# Altium schematic sheet CW308T_AVR_MICRO.SchDoc: AVR Microcontroller
size Letter; Organization: NewAE Technology Inc.; Address1: 1083 Queen St., Suite 196; Address2: Halifax; Address3: NS; Address4: Canada B3H 0B2; SheetNumber: 1; SheetTotal: 2; SheetApproved: YES
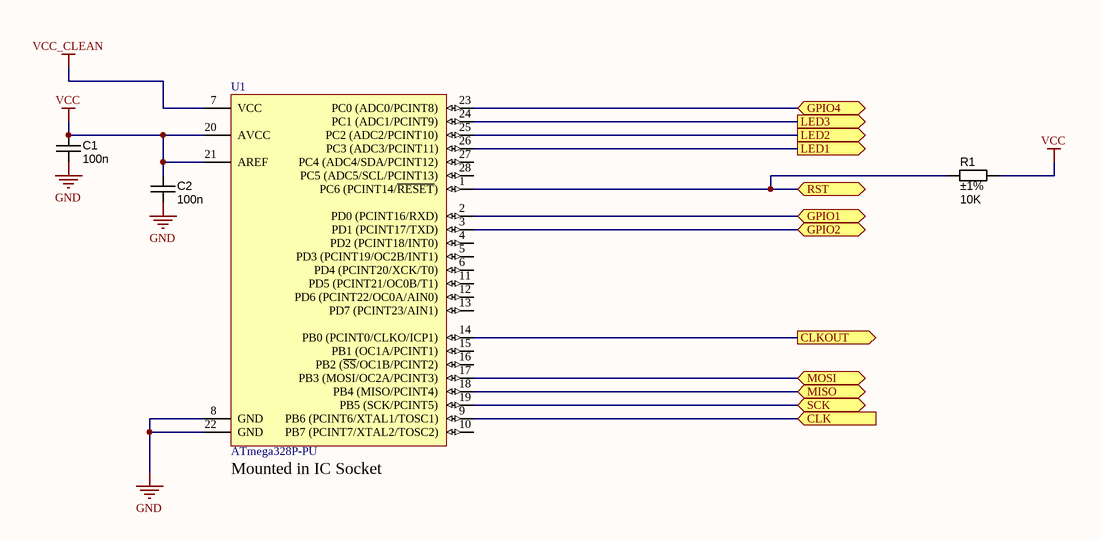
[diagram p0: CW308T_AVR_MICRO.SchDoc]

## Parts
C1  value 100n  [CAPC1608X90N]  (hidden comment: approved sub OK)
C2  value 100n  [CAPC1608X90N]  (hidden comment: approved sub OK)
R1  value 10K  Tolerance: ±1%  [RESC1608X55N]  (hidden comment: Thick Film)
U1  ATmega328P-PU  [28P3]

## Ports
CLK (in), CLKOUT (out), GPIO1 (bidir), GPIO2 (bidir), GPIO4 (bidir), LED1 (out), LED2 (out), LED3 (out), MISO (bidir), MOSI (bidir), RST (bidir), SCK (bidir)

## Nets
GND: C1.2 C2.2 U1.8(GND) U1.22(GND)
VCC: C1.1 C2.1 R1.1 U1.20(AVCC) U1.21(AREF)
VCC_CLEAN: U1.7(VCC)
CLK: U1.9(PB6_(PCINT6/XTAL1/TOSC1)) ; port CLK
CLKOUT: U1.14(PB0_(PCINT0/CLKO/ICP1)) ; port CLKOUT
GPIO1: U1.2(PD0_(PCINT16/RXD)) ; port GPIO1
GPIO2: U1.3(PD1_(PCINT17/TXD)) ; port GPIO2
GPIO4: U1.23(PC0_(ADC0/PCINT8)) ; port GPIO4
LED1: U1.26(PC3_(ADC3/PCINT11)) ; port LED1
LED2: U1.25(PC2_(ADC2/PCINT10)) ; port LED2
LED3: U1.24(PC1_(ADC1/PCINT9)) ; port LED3
MISO: U1.18(PB4_(MISO/PCINT4)) ; port MISO
MOSI: U1.17(PB3_(MOSI/OC2A/PCINT3)) ; port MOSI
RST: R1.2 U1.1(PC6_(PCINT14/~{RESET})) ; port RST
SCK: U1.19(PB5_(SCK/PCINT5)) ; port SCK

Not connected (* = marked no-connect by the designer): U1 4(PD2_(PCINT18/INT0)) 5(PD3_(PCINT19/OC2B/INT1)) 6(PD4_(PCINT20/XCK/T0)) 10(PB7_(PCINT7/XTAL2/TOSC2)) 11(PD5_(PCINT21/OC0B/T1)) 12(PD6_(PCINT22/OC0A/AIN0)) 13(PD7_(PCINT23/AIN1)) 15(PB1_(OC1A/PCINT1)) 16(PB2_(~{SS}/OC1B/PCINT2)) 27(PC4_(ADC4/SDA/PCINT12)) 28(PC5_(ADC5/SCL/PCINT13))

## Notes on the sheet
- (near U1) Mounted in IC Socket
- Title:
- Date:
- Rev:
- Time:
- Project:
- Sheet
- of
- License:
- Copyright © NewAE Technology Inc.
- Approved:
- NewAE.com
- File:

## Library data of the parts
C1 C2 = CAPC_100n_0603_X7R_50V_10%: Capacitor SMD Cer 100nF 10% 50V X7R 0603; Manufacturer 1: AVX Corporation; Manufacturer Part Number 1: 06035C104KAT2A; Ratings: 50V; X7R; Material: ceramic; SCDType: spec; Manufacturer 2: TDK Corporation; Manufacturer Part Number 2: C1608X7R1H104K; Package / Case: 0603 (1608 Metric); Tolerance: ±10%; Supplier 1: Digi-Key; Supplier Part Number 1: 478-5052-1-ND; ComponentLink1URL: http://www.avx.com/docs/Catalogs/cx7r.pdf; ComponentLink1Description: http://www.avx.com/docs/Catalogs/cx7r.pdf; Supplier 2: Digi-Key; Supplier Part Number 2: 445-1314-1-ND; ComponentLink2URL: http://product.tdk.com/capacitor/mlcc/en/documents/mlcc_commercial_general_en.pdf; ComponentLink2Description: http://product.tdk.com/capacitor/mlcc/en/documents/mlcc_commercial_general_en.pdf
R1 = RES_10K_0603_1%: Resistor SMD chip 10k Ohm 0.1W 1% 0603; Manufacturer 1: Yageo; Manufacturer Part Number 1: RC0603FR-0710KL; Ratings: 1/10W; SCDType: spec; Package / Case: 0603 (1608 Metric); Supplier 1: Digi-Key; Supplier Part Number 1: 311-10.0KHRCT-ND
U1 = CMP-0095-00013-2: 8-bit AVR Microcontroller, 32KB Flash, 1KB EEPROM, 2KB SRAM, 28-pin PDIP, Industrial Grade (-40°C to 85°C); RevisionNote: DatasheetVersion updated. URLs added.; PackageVersion: revB, Sep-2001; DatasheetVersion: revD, May-2011; ComponentLink1Description: Manufacturer URL; ComponentLink1URL: http://www.atmel.com/; PackageReference: 28P3; ComponentLink2Description: ATmega48A/48PA/88A/88PA/168A/168PA/328/328P Datasheet; ComponentLink3URL: http://www.atmel.com/dyn/resources/prod_documents/8271S.pdf; ComponentLink2URL: http://www.atmel.com/dyn/resources/prod_documents/8271.pdf; ComponentLink3Description: ATmega48A/48PA/88A/88PA/168A/168PA/328/328P Summary